# Altium project dipext-pin.PrjPcb
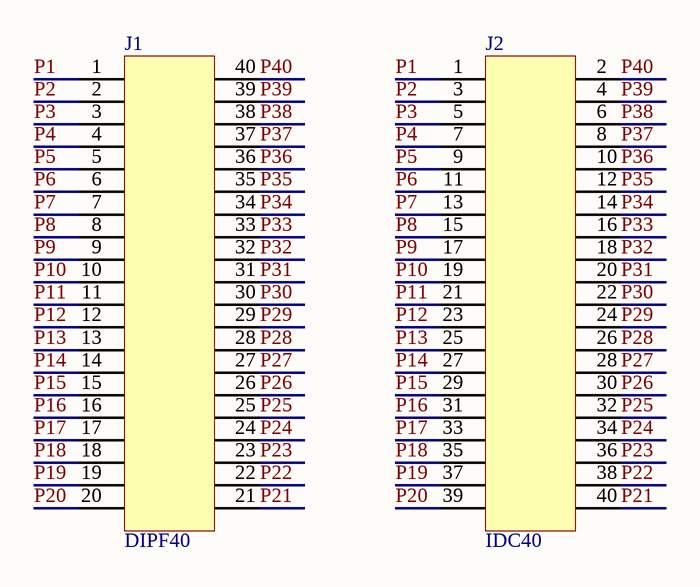
[diagram p0: top.SchDoc]
1 sheet, 2 parts. Net scope: global (net labels, ports and power ports of the same name join across sheets).
Board file: dipext-pin_r3.PcbDoc

## Sheet top.SchDoc
size A

### Parts
J1  DIPF40  [DIPF40]
J2  IDC40  [IDC40]

### Nets
P1: J1.1 J2.1
P2: J1.2 J2.3
P3: J1.3 J2.5
P4: J1.4 J2.7
P5: J1.5 J2.9
P6: J1.6 J2.11
P7: J1.7 J2.13
P8: J1.8 J2.15
P9: J1.9 J2.17
P10: J1.10 J2.19
P11: J1.11 J2.21
P12: J1.12 J2.23
P13: J1.13 J2.25
P14: J1.14 J2.27
P15: J1.15 J2.29
P16: J1.16 J2.31
P17: J1.17 J2.33
P18: J1.18 J2.35
P19: J1.19 J2.37
P20: J1.20 J2.39
P21: J1.21 J2.40
P22: J1.22 J2.38
P23: J1.23 J2.36
P24: J1.24 J2.34
P25: J1.25 J2.32
P26: J1.26 J2.30
P27: J1.27 J2.28
P28: J1.28 J2.26
P29: J1.29 J2.24
P30: J1.30 J2.22
P31: J1.31 J2.20
P32: J1.32 J2.18
P33: J1.33 J2.16
P34: J1.34 J2.14
P35: J1.35 J2.12
P36: J1.36 J2.10
P37: J1.37 J2.8
P38: J1.38 J2.6
P39: J1.39 J2.4
P40: J1.40 J2.2

### Library data of the parts
J1 = DIPF40: DIP40 ZIF